# EasyEDA schematic SCH_MulFuncPerCalendar_2024-10-28.json
TITLE: Sheet_1; REV: 1.0; Date: 2020-03-02; Sheet: 1/1; Drawn By: STM32EDA; Company: Your Company
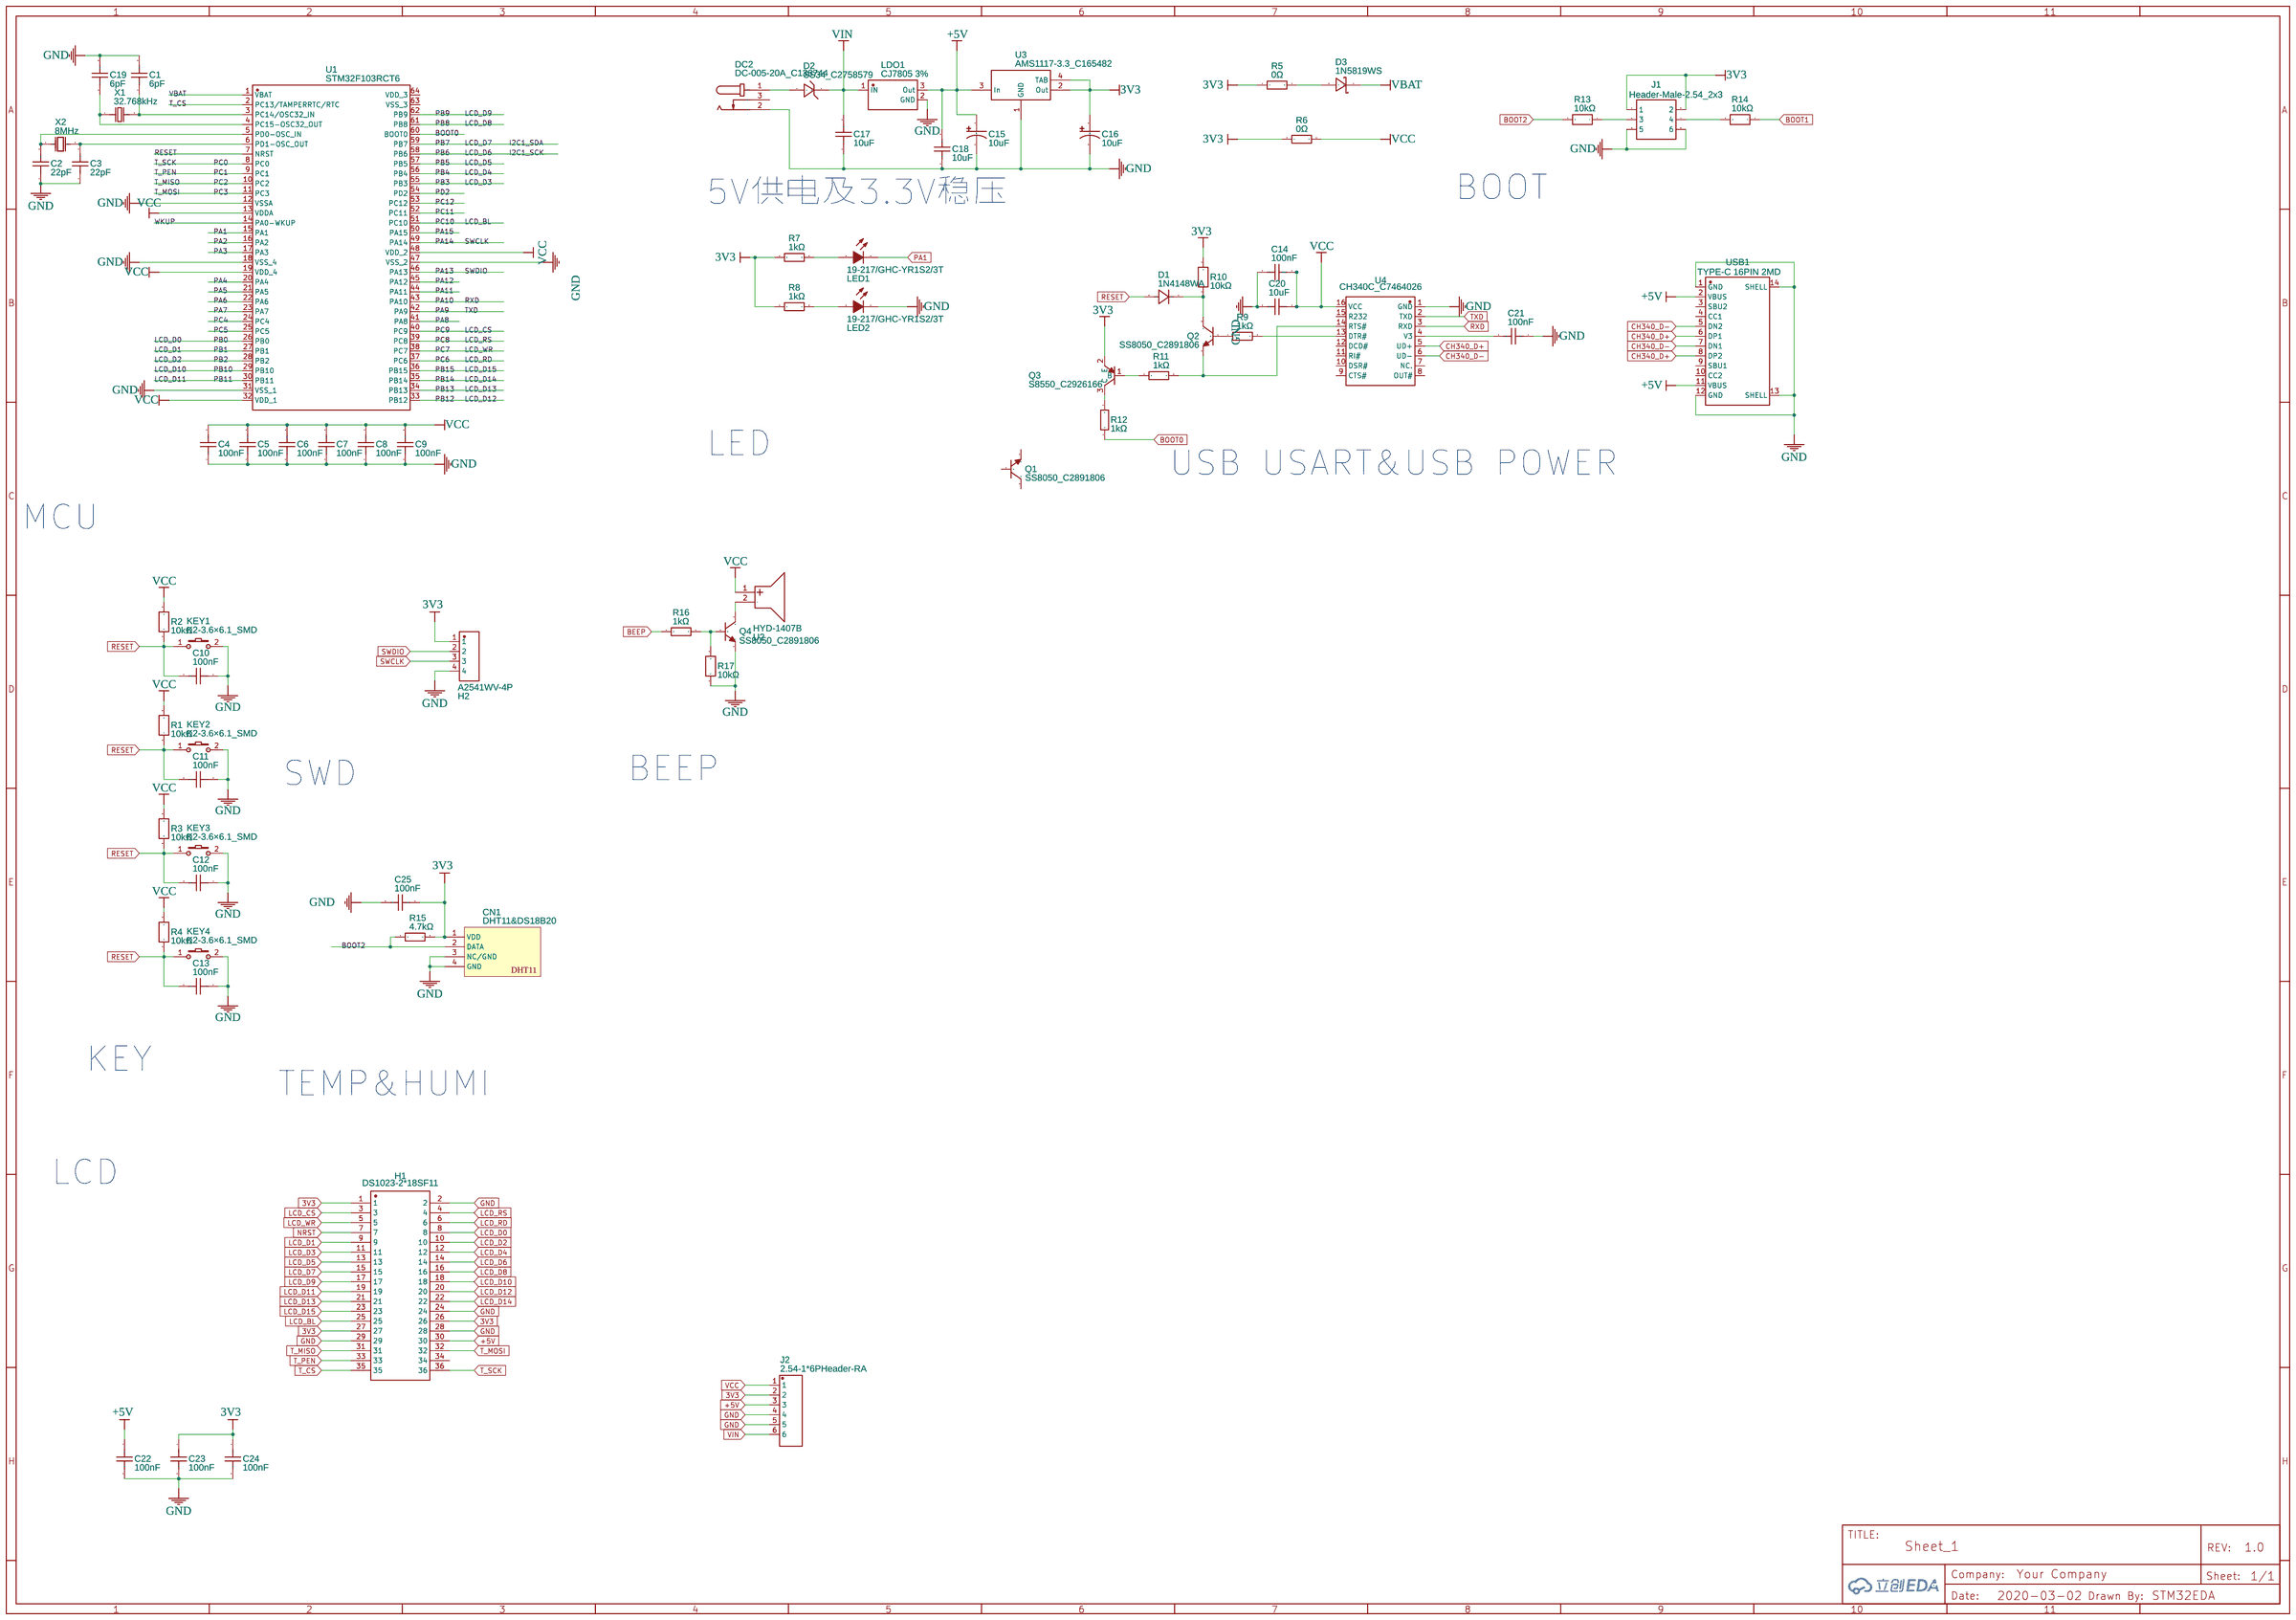
[diagram p0: schematic sheet]

## Parts
C1  6pF  [C0603]
C2  22pF  [C0603]
C3  22pF  [C0603]
C4  100nF  [C0603]
C5  100nF  [C0603]
C6  100nF  [C0603]
C7  100nF  [C0603]
C8  100nF  [C0603]
C9  100nF  [C0603]
C10  100nF  [C0603]
C11  100nF  [C0603]
C12  100nF  [C0603]
C13  100nF  [C0603]
C14  100nF  [C0603]
C15  10uF  [CAP-SMD_L3.2-W1.6]
C16  10uF  [CAP-SMD_L3.2-W1.6]
C17  10uF  [C0603]
C18  10uF  [C0603]
C19  6pF  [C0603]
C20  10uF  [C0603]
C21  100nF  [C0603]
C22  100nF  [C0603]
C23  100nF  [C0603]
C24  100nF  [C0603]
C25  100nF  [C0603]
CN1  DHT11&DS18B20  [DHT11&DS18B20]
D1  1N4148WA  [SOD-123_L2.7-W1.7-LS3.8-RD]
D2  SS34_C2758579  [SMA_L4.3-W2.7-LS5.1-RD]
D3  1N5819WS  [SOD-323_L1.8-W1.3-LS2.5-RD]
DC2  DC-005-20A_C136744  [DC-IN-TH_DC-005-20A]
H1  DS1023-2*18SF11  [HDR-TH_36P-P2.54-V-F-R2-C18-S2.54-1]
H2  A2541WV-4P  [HDR-TH_4P-P2.54-V-M]
J1  Header-Male-2.54_2x3  [HDR-TH_6P-P2.54-V-M-R2-C3-S2.54-1]
J2  2.54-1*6PHeader-RA  [HDR-TH_6P-P2.54-H-M-W10.0]
KEY1  K2-3.6×6.1_SMD  [KEY-SMD_2P-L6.2-W3.6-LS8.0]
KEY2  K2-3.6×6.1_SMD  [KEY-SMD_2P-L6.2-W3.6-LS8.0]
KEY3  K2-3.6×6.1_SMD  [KEY-SMD_2P-L6.2-W3.6-LS8.0]
KEY4  K2-3.6×6.1_SMD  [KEY-SMD_2P-L6.2-W3.6-LS8.0]
LDO1  CJ7805 3%  [TO-252-2_L6.6-W6.1-P4.58-LS10.1-BR-CW]
LED1  19-217/GHC-YR1S2/3T  [LED0603-RD]
LED2  19-217/GHC-YR1S2/3T  [LED0603-RD]
Q1  SS8050_C2891806  [SOT-23-3_L2.9-W1.3-P1.90-LS2.4-BR]
Q2  SS8050_C2891806  [SOT-23-3_L2.9-W1.3-P1.90-LS2.4-BR]
Q3  S8550_C2926166  [SOT-23-3_L2.9-W1.3-P1.90-LS2.4-BR]
Q4  SS8050_C2891806  [SOT-23-3_L2.9-W1.3-P1.90-LS2.4-BR]
R1  10kΩ  [R0603]
R2  10kΩ  [R0603]
R3  10kΩ  [R0603]
R4  10kΩ  [R0603]
R5  0Ω  [R0603]
R6  0Ω  [R0603]
R7  1kΩ  [R0603]
R8  1kΩ  [R0603]
R9  1kΩ  [R0603]
R10  10kΩ  [R0603]
R11  1kΩ  [R0603]
R12  1kΩ  [R0603]
R13  10kΩ  [R0603]
R14  10kΩ  [R0603]
R15  4.7kΩ  [R0603]
R16  1kΩ  [R0603]
R17  10kΩ  [R0603]
U1  STM32F103RCT6  [LQFP-64_L10.0-W10.0-P0.50-LS12.0-BL]
U2  HYD-1407B  [BUZ-TH_BD14.1-P7.62-D1.0-FD]
U3  AMS1117-3.3_C165482  [SOT-223_L6.5-W3.5-P2.30-LS7.0-BR]
U4  CH340C_C7464026  [SOP-16_L10.0-W3.9-P1.27-LS6.0-BL]
USB1  TYPE-C 16PIN 2MD  [USB-C-SMD_TYPE-C-6PIN-2MD-073]
X1  32.768kHz  [FC-135R_L3.2-W1.5]
X2  8MHz  [HC-49S_L11.4-W4.8]

## Library data of the parts
C1 C19 = 0603N6R0B500CT: Contributor: LCSC; Supplier: LCSC; Supplier Part: C458907; Manufacturer: Walsin(华新科); JLCPCB Part Class: Extended Part
C2 C3 = 06035A220FAT2A: Contributor: LCSC; Supplier: LCSC; Supplier Part: C597146; Manufacturer: Kyocera AVX; JLCPCB Part Class: Extended Part
C4-C9 = C1608X7R1E104M080AA: Contributor: lcsc; Supplier: LCSC; Supplier Part: C3839111; Manufacturer: TDK; JLCPCB Part Class: Extended Part
C10-C14 C21-C25 = CC0603JRX7R8BB104: Contributor: LCSC; Supplier: LCSC; Supplier Part: C327087; Manufacturer: YAGEO(国巨); JLCPCB Part Class: Extended Part
C15 C16 = CA45-A-10V-10μF-K: Contributor: LCSC; Supplier: LCSC; Supplier Part: C185772; Manufacturer: TORCH(火炬); JLCPCB Part Class: Extended Part
C17 C18 C20 = GRM188R6YA106MA73D: Contributor: lcsc; Supplier: LCSC; Supplier Part: C194427; Manufacturer: muRata(村田); JLCPCB Part Class: Extended Part
CN1 = DHT11&DS18B20: Contributor: keitty
D1 = 1N4148WA: Contributor: lcsc; Supplier: LCSC; Supplier Part: C2977359; Manufacturer: PJSEMI(平晶微); JLCPCB Part Class: Extended Part
D2 = SS34_C2758579: Contributor: lcsc; Supplier: LCSC; Supplier Part: C2758579; Manufacturer: UMW(友台半导体); Manufacturer Part: SS34; JLCPCB Part Class: Extended Part
D3 = 1N5819WS: Contributor: LCSC; Supplier: LCSC; Supplier Part: C191023; Manufacturer: Hottech(合科泰); JLCPCB Part Class: Basic Part
DC2 = DC-005-20A_C136744: Contributor: LCSC; Supplier: LCSC; Manufacturer: 韩国韩荣; Manufacturer Part: DC-005-20A; Supplier Part: C136744; JLCPCB Part Class: Extended Part
H1 = DS1023-2*18SF11: Contributor: LCSC; Supplier: LCSC; Manufacturer: CONNFLY; Supplier Part: C132131; JLCPCB Part Class: Extended Part
H2 = A2541WV-4P: Contributor: LCSC; Supplier: LCSC; Supplier Part: C225479; Manufacturer: CJT(长江连接器); JLCPCB Part Class: Extended Part
J1 = Header-Male-2.54_2x3: Supplier: LCSC; Manufacturer: BOOMELE(博穆精密); Manufacturer Part: 2.54-2*3P针; Supplier Part: C65114; JLCPCB Part Class: Extended Part
J2 = 2.54-1*6PHeader-RA: Supplier: LCSC; Manufacturer: BOOMELE(博穆精密); Manufacturer Part: 2.54-1*6P反弯排针; Supplier Part: C56816; JLCPCB Part Class: Extended Part
KEY1-KEY4 = K2-3.6×6.1_SMD: Supplier Part: C118141; Supplier: LCSC; Manufacturer Part: K2-1107ST-A4SW-06; Contributor: LCEDA_Lib; 制造商: 韩国韩荣
LDO1 = CJ7805 3%: Supplier: LCSC; Manufacturer: CJ(江苏长电/长晶); Supplier Part: C21706; JLCPCB Part Class: Extended Part
LED1 LED2 = 19-217/GHC-YR1S2/3T: Supplier: LCSC; Manufacturer: EVERLIGHT(亿光); Supplier Part: C72043; JLCPCB Part Class: Extended Part
Q1 Q2 Q4 = SS8050_C2891806: Contributor: LCSC; Supplier: LCSC; Supplier Part: C2891806; Manufacturer: YONGYUTAI(永裕泰); Manufacturer Part: SS8050; JLCPCB Part Class: Extended Part
Q3 = S8550_C2926166: Contributor: LCSC; Supplier: LCSC; Supplier Part: C2926166; Manufacturer: FOSAN(富信); Manufacturer Part: S8550; JLCPCB Part Class: Extended Part
R1-R4 R10 R13 R14 R17 = SC0603J1002F2BNRH: Contributor: lcsc; Supplier: LCSC; Supplier Part: C3152154; Manufacturer: Sunway(信维通信); JLCPCB Part Class: Extended Part
R5 R6 = 0603WAF0000T5E: Supplier: LCSC; Manufacturer: UNI-ROYAL(厚声); Supplier Part: C21189; JLCPCB Part Class: Basic Part
R7-R9 R11 R12 R16 = 0603WAF1001T5E: Supplier: LCSC; Manufacturer: UNI-ROYAL(厚声); Supplier Part: C21190; JLCPCB Part Class: Basic Part
R15 = 4.7K  0603  SOP: Contributor: LCSC; Supplier: LCSC; Supplier Part: C347068; Manufacturer: FH(风华); Manufacturer Part: ACD03K4701FT; JLCPCB Part Class: Extended Part
U1 = STM32F103RCT6: Supplier: LCSC; Manufacturer: ST(意法半导体); Supplier Part: C8323; JLCPCB Part Class: Extended Part
U2 = HYD-1407B: Supplier: LCSC; Supplier Part: C7544841; Manufacturer: HYDZ(华宇); Contributor: lcsc; JLCPCB Part Class: Extended Part
U3 = AMS1117-3.3_C165482: Contributor: LCSC; Supplier: LCSC; Supplier Part: C165482; Manufacturer: SHIKUES(时科); Manufacturer Part: SK1117-3.3; JLCPCB Part Class: Extended Part
U4 = CH340C_C7464026: Contributor: lcsc; Supplier: LCSC; Supplier Part: C7464026; Manufacturer: WCH(南京沁恒); Manufacturer Part: CH340C; JLCPCB Part Class: Extended Part
USB1 = TYPE-C 16PIN 2MD(073): Contributor: LCSC; Supplier: LCSC; Supplier Part: C2765186; Manufacturer: SHOU HAN(首韩); JLCPCB Part Class: Extended Part
X1 = Q13FC1350000200: Supplier: LCSC; Manufacturer Part: Q13FC13500002; Manufacturer: EPSON(爱普生); Supplier Part: C48615; JLCPCB Part Class: Extended Part
X2 = ESB8.00000F20E22: Supplier: LCSC; Manufacturer: HOSONIC(鸿星); Supplier Part: C99135; JLCPCB Part Class: Extended Part

## Nets
3V3: C16.1 C23.1 C24.1 C25.1 CN1.1(VDD) H1.1 H1.26 H1.27 H2.1 J1.1 J1.2 J2.2 Q3.2(E) R5.1 R6.1 R7.1 R8.1 R10.2 R15.2 U3.2(Out) U3.4(TAB)
+5V: C15.1 C18.2 C22.1 H1.30 J2.3 LDO1.3(Out) U3.3(In) USB1.2(VBUS) USB1.11(VBUS)
GND: C1.2 C2.1 C3.1 C4.1 C5.1 C6.1 C7.1 C8.1 C9.1 C10.1 C11.1 C12.1 C13.1 C14.2 C15.2 C16.2 C17.1 C18.1 C19.2 C20.2 C21.1 C22.2 C23.2 C24.2 C25.2 CN1.3(NC/GND) CN1.4(GND) DC2.2 H1.2 H1.24 H1.28 H1.29 H2.4 J1.5 J1.6 J2.4 J2.5 KEY1.2 KEY2.2 KEY3.2 KEY4.2 LDO1.2(GND) LED2.1(C) Q4.2(E) R17.1 U1.12(VSSA) U1.18(VSS_4) U1.31(VSS_1) U1.47(VSS_2) U3.1(GND) U4.1(GND) USB1.1(GND) USB1.12(GND) USB1.13(SHELL) USB1.14(SHELL)
VBAT: D3.1(K) U1.1(VBAT)
VCC: C4.2 C5.2 C6.2 C7.2 C8.2 C9.2 C14.1 C20.1 J2.1 R1.2 R2.2 R3.2 R4.2 R6.2 U1.13(VDDA) U1.19(VDD_4) U1.32(VDD_1) U1.48(VDD_2) U2.1(+) U4.16(VCC)
VIN: C17.2 D2.1(C) J2.6 LDO1.1(IN)
BEEP: R16.2
BOOT0: R12.1 U1.60(BOOT0)
BOOT1: R14.1
BOOT2: CN1.2(DATA) R13.2 R15.1
CH340_D+: U4.5(UD+) USB1.6(DP1) USB1.8(DP2)
CH340_D-: U4.6(UD-) USB1.5(DN2) USB1.7(DN1)
I2C1_SCK: H1.14 U1.58(PB6)
I2C1_SDA: H1.15 U1.59(PB7)
LCD_BL: H1.25 U1.51(PC10)
LCD_CS: H1.3 U1.40(PC9)
LCD_D0: H1.8 U1.26(PB0)
LCD_D1: H1.9 U1.27(PB1)
LCD_D2: H1.10 U1.28(PB2)
LCD_D3: H1.11 U1.55(PB3)
LCD_D4: H1.12 U1.56(PB4)
LCD_D5: H1.13 U1.57(PB5)
LCD_D8: H1.16 U1.61(PB8)
LCD_D9: H1.17 U1.62(PB9)
LCD_D10: H1.18 U1.29(PB10)
LCD_D11: H1.19 U1.30(PB11)
LCD_D12: H1.20 U1.33(PB12)
LCD_D13: H1.21 U1.34(PB13)
LCD_D14: H1.22 U1.35(PB14)
LCD_D15: H1.23 U1.36(PB15)
LCD_RD: H1.6 U1.37(PC6)
LCD_RS: H1.4 U1.39(PC8)
LCD_WR: H1.5 U1.38(PC7)
NRST: H1.7
PA1: LED1.1(C) U1.15(PA1)
PA2: U1.16(PA2)
PA3: U1.17(PA3)
PA4: U1.20(PA4)
PA5: U1.21(PA5)
PA6: U1.22(PA6)
PA7: U1.23(PA7)
PA8: U1.41(PA8)
PA9: U1.42(PA9) U4.2(TXD)
PA10: U1.43(PA10) U4.3(RXD)
PA11: U1.44(PA11)
PA12: U1.45(PA12)
PA13: H2.2 U1.46(PA13)
PA14: H2.3 U1.49(PA14)
PA15: U1.50(PA15)
PC0: H1.36 U1.8(PC0)
PC1: H1.33 U1.9(PC1)
PC2: H1.31 U1.10(PC2)
PC3: H1.32 U1.11(PC3)
PC4: U1.24(PC4)
PC5: U1.25(PC5)
PC11: U1.52(PC11)
PC12: U1.53(PC12)
PD2: U1.54(PD2)
RESET: C10.2 C11.2 C12.2 C13.2 D1.2(A) KEY1.1 KEY2.1 KEY3.1 KEY4.1 R1.1 R2.1 R3.1 R4.1 U1.7(NRST)
T_CS: H1.35 U1.2(PC13/TAMPERRTC/RTC)
WKUP: U1.14(PA0-WKUP)
Net-(C1-1): C1.1 U1.3(PC14/OSC32_IN) X1.2
Net-(C2-2): C2.2 U1.5(PD0-OSC_IN) X2.1(OSC1)
Net-(C3-2): C3.2 U1.6(PD1-OSC_OUT) X2.2(OSC2)
Net-(C19-1): C19.1 U1.4(PC15-OSC32_OUT) X1.1
Net-(C21-2): C21.2 U4.4(V3)
Net-(D1-1): D1.1(K) Q2.3(C) R10.1
Net-(D2-2): D2.2(A) DC2.1
Net-(D3-2): D3.2(A) R5.2
Net-(J1-3): J1.3 R13.1
Net-(J1-4): J1.4 R14.2
Net-(LED1-2): LED1.2(A) R7.2
Net-(LED2-2): LED2.2(A) R8.2
Net-(Q2-1): Q2.1(B) R9.1
Net-(Q2-2): Q2.2(E) R11.2 U4.14(RTS#)
Net-(Q3-1): Q3.1(B) R11.1
Net-(Q3-3): Q3.3(C) R12.2
Net-(Q4-1): Q4.1(B) R16.1 R17.2
Net-(Q4-3): Q4.3(C) U2.2(-)
Net-(R9-2): R9.2 U4.13(DTR#)

Not connected (* = marked no-connect by the designer): DC2 3; H1 34; Q1 1(B) 2(E) 3(C); U1 63(VSS_3) 64(VDD_3); U4 7(NC.) 8(OUT#) 9(CTS#) 10(DSR#) 11(RI#) 12(DCD#) 15(R232); USB1 3(SBU2) 4(CC1) 9(SBU1) 10(CC2)

## Notes on the sheet
- BOOT
- 5V供电及3.3V稳压
- LED
- USB USART&USB POWER
- MCU
- BEEP
- SWD
- KEY
- TEMP&HUMI
- LCD
